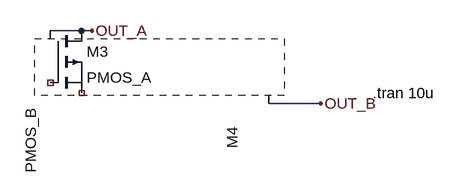
[diagram p0: schematic case_10.asc]
case_10.asc, the LTspice schematic file:
Version 4.1
SHEET 1 880 680
WIRE 304 144 368 144
WIRE 640 256 720 256
FLAG 368 144 OUT_A
FLAG 720 256 OUT_B
SYMBOL pmos 304 144 R0
SYMATTR InstName M3
SYMATTR Value PMOS_A
SYMATTR Type pmos
SYMBOL Power\pmos 640 256 R90
WINDOW 0 36 56 Left 2
SYMATTR InstName M4
SYMATTR Value PMOS_B
SYMATTR SpiceLine m=8
TEXT 800 240 Left 2 !.tran 10u

The netlist it stands for:
* case_10.asc
M3 OUT_A NC_01 NC_02 NC_02 PMOS_A
* M4: PMOS_B m=8 (symbol Power\pmos not available, pin order unknown); nets seen at it: OUT_A, OUT_B
.model NMOS NMOS
.model PMOS PMOS
.lib standard.mos
.tran 10u
.backanno
.end